# EAGLE design ESP32-Mini-Matrix-Shield-DMA (EAGLE 9.6.2)
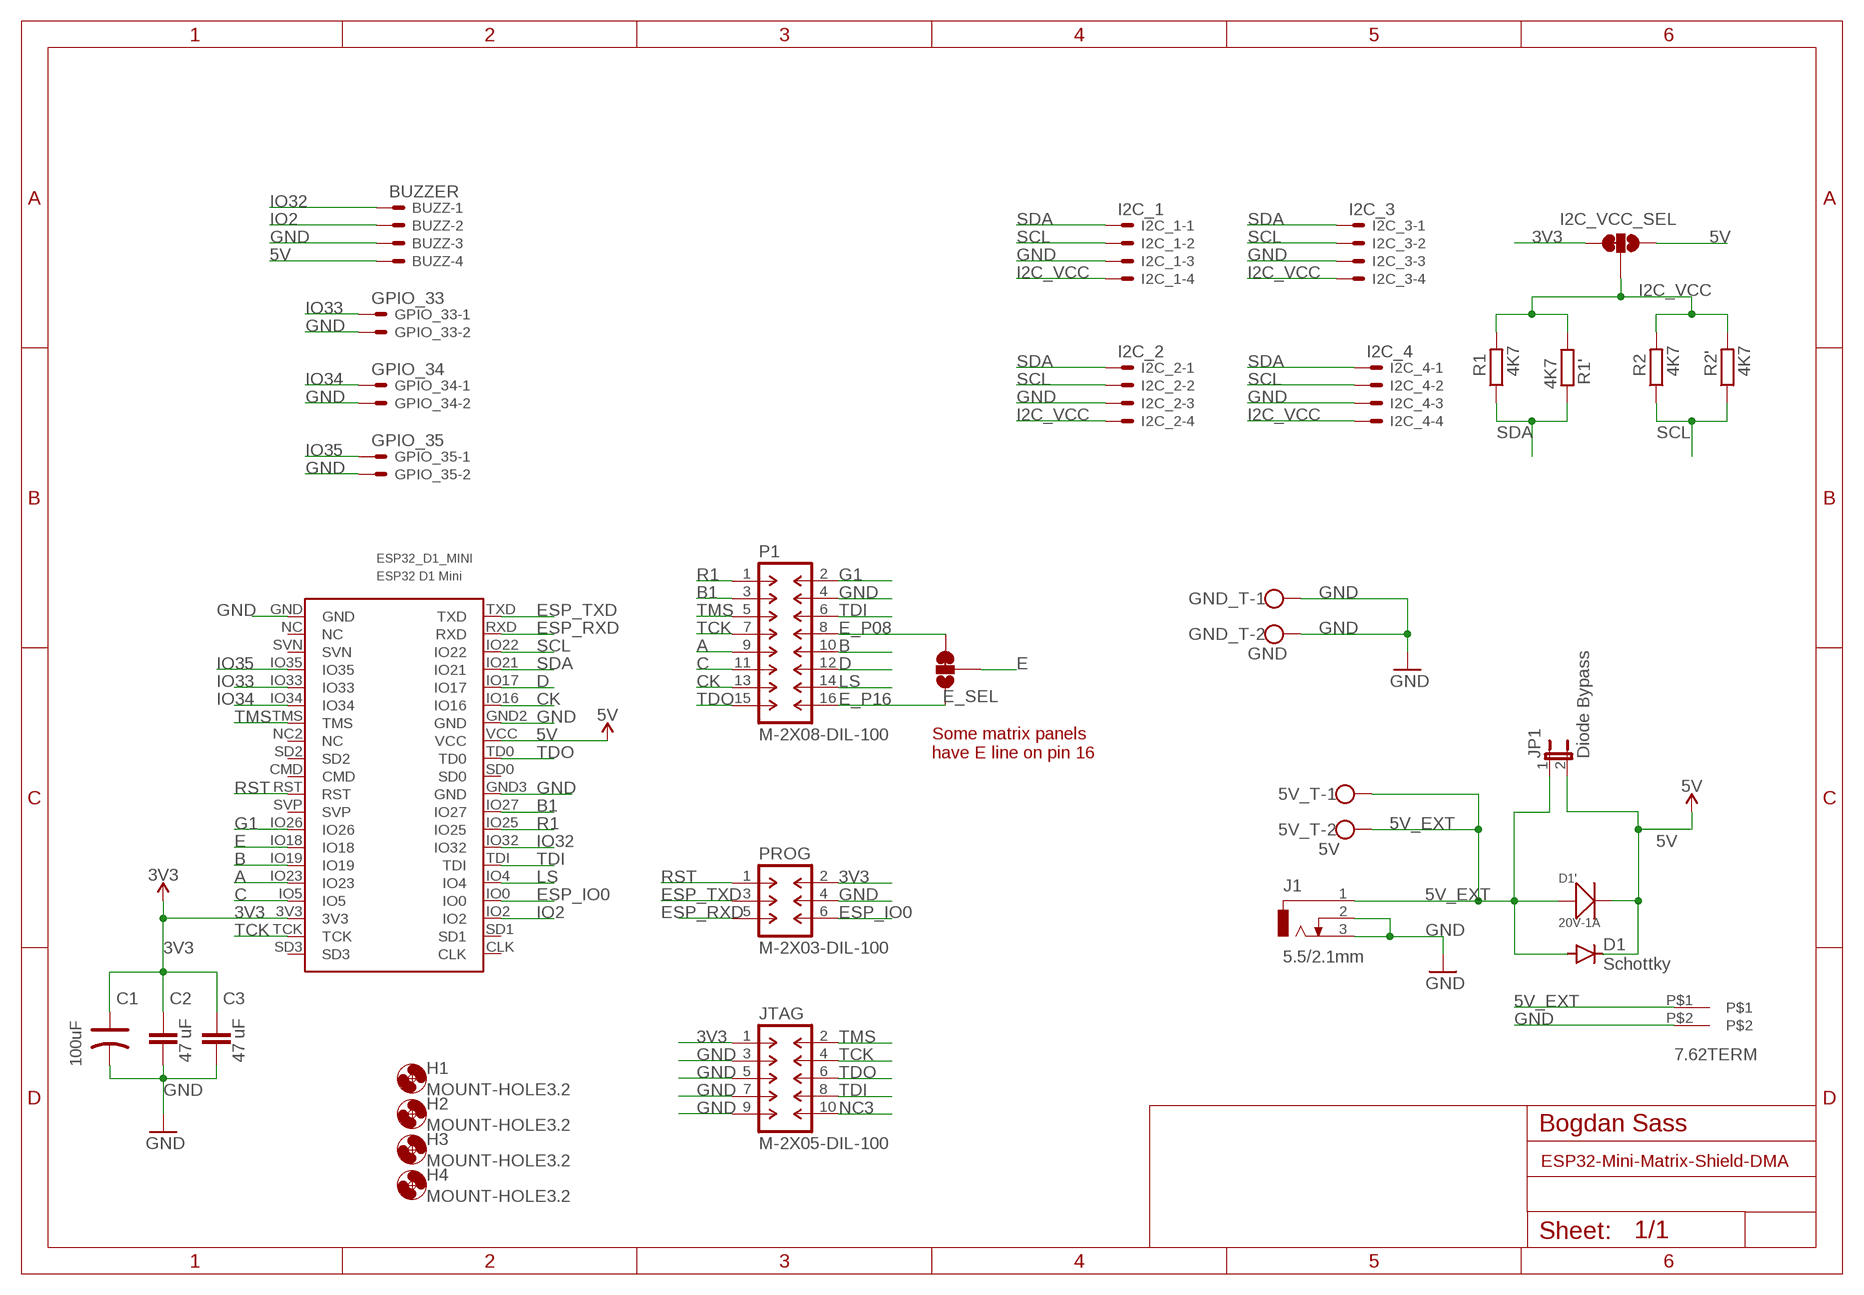
[diagram p0: schematic, sheet 1]

## Parts
5V_T  5V  W237-102  [W237-102]
BUZZ  BUZZER  JST-XH-04-PIN-LONG-PAD  [JST-XH-04-PACKAGE-LONG-PAD]
C1  100uF  DIP-ALUMINUM-47UF-16V(D5-H7MM)  [PC-D5.3MM]
C2  47 uF  CAP0805-CAP-LARGEPADS  [0805-CAP-LARGEPADS]
C3  47 uF  CAP0805-CAP-LARGEPADS  [0805-CAP-LARGEPADS]
D1  Schottky  1N4004  [DO41-10]
D1'  20V-1A  SMD-DIODE-SCHOTTKY-20V-1A(SOD-123)  [SOD-123]
E_SEL  JUMPER-SMT_3_1-NC_TRACE_SILK  [SMT-JUMPER_3_1-NC_TRACE_SILK]
ESP32_D1_MINI  ESP32 D1 Mini  MH-ET_ESP32_D1_MINI  [MH-ET_ESP32_D1_MINI]
GND_T  GND  W237-102  [W237-102]
GPIO_33  GPIO_33  JST-XH-02-PIN-LONG-PAD  [JST-XH-02-PACKAGE-LONG-PAD]
GPIO_34  GPIO_34  JST-XH-02-PIN-LONG-PAD  [JST-XH-02-PACKAGE-LONG-PAD]
GPIO_35  GPIO_35  JST-XH-02-PIN-LONG-PAD  [JST-XH-02-PACKAGE-LONG-PAD]
H1  MOUNT-HOLE3.2  [3,2]
H2  MOUNT-HOLE3.2  [3,2]
H3  MOUNT-HOLE3.2  [3,2]
H4  MOUNT-HOLE3.2  [3,2]
I2C_1  I2C_1  JST-XH-04-PIN-LONG-PAD  [JST-XH-04-PACKAGE-LONG-PAD]
I2C_2  I2C_2  JST-XH-04-PIN-LONG-PAD  [JST-XH-04-PACKAGE-LONG-PAD]
I2C_3  I2C_3  JST-XH-04-PIN-LONG-PAD  [JST-XH-04-PACKAGE-LONG-PAD]
I2C_4  I2C_4  JST-XH-04-PIN-LONG-PAD  [JST-XH-04-PACKAGE-LONG-PAD]
I2C_VCC_SEL  JUMPER-SMT_3_1-NC_TRACE_SILK  [SMT-JUMPER_3_1-NC_TRACE_SILK]
J1  5.5/2.1mm  DCJ0303  [DCJ0303]
JP1  Diode Bypass  JP1E  [JP1]
JTAG  M-2X05-DIL-100  [DIL-100-2X05]
P1  M-2X08-DIL-100  [DIL-100-2X08]
PROG  M-2X03-DIL-100  [DIL-100-2X03]
R1  4K7  R-EU_0207/10  [0207/10]
R1'  4K7  R-EU_M0805  [M0805]
R2  4K7  R-EU_0207/10  [0207/10]
R2'  4K7  R-EU_M0805  [M0805]
ST_01  ST_01  CON-TERM-7.62  [CON-TERM-7.62]

## Nets
3V3: C1.+ C2.1 C3.1 ESP32_D1_MINI.3V3 I2C_VCC_SEL.3 JTAG.1 PROG.2
5V: BUZZ.4 D1'.- D1.C ESP32_D1_MINI.VCC I2C_VCC_SEL.1 JP1.2
5V_EXT: 5V_T.1 5V_T.2 D1'.+ D1.A J1.1 JP1.1 ST_01.P$1
A: ESP32_D1_MINI.IO23 P1.9
B: ESP32_D1_MINI.IO19 P1.10
B1: ESP32_D1_MINI.IO27 P1.3
C: ESP32_D1_MINI.IO5 P1.11
CK: ESP32_D1_MINI.IO16 P1.13
D: ESP32_D1_MINI.IO17 P1.12
E: E_SEL.2 ESP32_D1_MINI.IO18
E_P08: E_SEL.3 P1.8
E_P16: E_SEL.1 P1.16
ESP_IO0: ESP32_D1_MINI.IO0 PROG.6
ESP_RXD: ESP32_D1_MINI.RXD PROG.5
ESP_TXD: ESP32_D1_MINI.TXD PROG.3
G1: ESP32_D1_MINI.IO26 P1.2
GND: BUZZ.3 C1.- C2.2 C3.2 ESP32_D1_MINI.GND ESP32_D1_MINI.GND2(GND) ESP32_D1_MINI.GND3(GND) GND_T.1 GND_T.2 GPIO_33.2 GPIO_34.2 GPIO_35.2 I2C_1.3 I2C_2.3 I2C_3.3 I2C_4.3 J1.2 J1.3 JTAG.3 JTAG.5 JTAG.7 JTAG.9 P1.4 PROG.4 ST_01.P$2
I2C_VCC: I2C_1.4 I2C_2.4 I2C_3.4 I2C_4.4 I2C_VCC_SEL.2 R1'.1 R1.2 R2'.2 R2.2
IO2: BUZZ.2 ESP32_D1_MINI.IO2
IO32: BUZZ.1 ESP32_D1_MINI.IO32
IO33: ESP32_D1_MINI.IO33 GPIO_33.1
IO34: ESP32_D1_MINI.IO34 GPIO_34.1
IO35: ESP32_D1_MINI.IO35 GPIO_35.1
LS: ESP32_D1_MINI.IO4 P1.14
NC3: JTAG.10
R1: ESP32_D1_MINI.IO25 P1.1
RST: ESP32_D1_MINI.RST PROG.1
SCL: ESP32_D1_MINI.IO22 I2C_1.2 I2C_2.2 I2C_3.2 I2C_4.2 R2'.1 R2.1
SDA: ESP32_D1_MINI.IO21 I2C_1.1 I2C_2.1 I2C_3.1 I2C_4.1 R1'.2 R1.1
TCK: ESP32_D1_MINI.TCK JTAG.4 P1.7
TDI: ESP32_D1_MINI.TDI JTAG.8 P1.6
TDO: ESP32_D1_MINI.TD0 JTAG.6 P1.15
TMS: ESP32_D1_MINI.TMS JTAG.2 P1.5
Unconnected: ESP32_D1_MINI.CLK ESP32_D1_MINI.CMD ESP32_D1_MINI.NC ESP32_D1_MINI.NC2(NC) ESP32_D1_MINI.SD0 ESP32_D1_MINI.SD1 ESP32_D1_MINI.SD2 ESP32_D1_MINI.SD3 ESP32_D1_MINI.SVN ESP32_D1_MINI.SVP

## Notes on the sheet
- Some matrix panels
  have E line on pin 16
- Bogdan Sass

## Library data of the parts
5V_T GND_T = con-wago-500:W237-102: WAGO SCREW CLAMP; MPN: 237-102; OC_FARNELL: unknown; OC_NEWARK: 70K9898
BUZZ I2C_1-I2C_4 = Rembrandt Electronics - JST XH Connectors v1-0:JST-XH-04-PIN: JST XH Connector 2 Pin Wire to board connector. Pitch: 2,54 mm, (0.100") Number of pins: 4 Created by Rembrandt Electronics www.rembrandtelectronics.com
C1 = Seeed-Capacitor:DIP-ALUMINUM-47UF-16V(D5-H7MM): 302030033; MPN: KS 100uF/16V; VALUE: 100uf
C2 C3 = _c2h:CAP: Capacitor Standard 0603 ceramic capacitor, and 0.1" leaded capacitor.
D1 = diode:1N4004: DIODE general purpose rectifier, 1 A
D1' = OPL_Discrete_Semiconductor:SMD-DIODE-SCHOTTKY-20V-1A(SOD-123): 304020034; MPN: B5819W
E_SEL I2C_VCC_SEL = SparkFun-Jumpers:JUMPER-SMT_3_1-NC_TRACE: Normally closed trace jumper (1 of 2 connections) This jumper has a trace between two pads so it's normally closed (NC). The other connection is normally open (NO). Use a razor knife to open the connection. For best results follow the IPC guidelines for cutting traces: Cutout at least 0.063 mm (0.005 in). Remove all loose material to clean up the cut area. Seal the cut with an approved epoxy. Reapply solder to reclose the connection, or to close the NO connection.
ESP32_D1_MINI = MH-ET_ESP32_D1_MINI:MH-ET_ESP32_D1_MINI
GPIO_33-GPIO_35 = Rembrandt Electronics - JST XH Connectors v1-0:JST-XH-02-PIN: JST XH Connector 2 Pin Wire to board connector. Pitch: 2,54 mm, (0.100") Number of pins: 2 Created by Rembrandt Electronics www.rembrandtelectronics.com
H1-H4 = holes:MOUNT-HOLE: MOUNTING HOLE with drill center marker
J1 = con-jack:DCJ0303: DC POWER JACK Source: DCJ0303.pdf; OC_FARNELL: unknown; OC_NEWARK: unknown
JP1 = jumper:JP1E: JUMPER
JTAG = con-headers-jp:M-2X05-: MALE HEADER
P1 = con-headers-jp:M-2X08-: MALE HEADER
PROG = con-headers-jp:M-2X03-: MALE HEADER
R1 R1' R2 R2' = rcl:R-EU_: RESISTOR, European symbol; SPICEPREFIX: R
ST_01 = terminal-block:CON-TERM-7.62: 7.62mm screw terminal barrier block

## Board
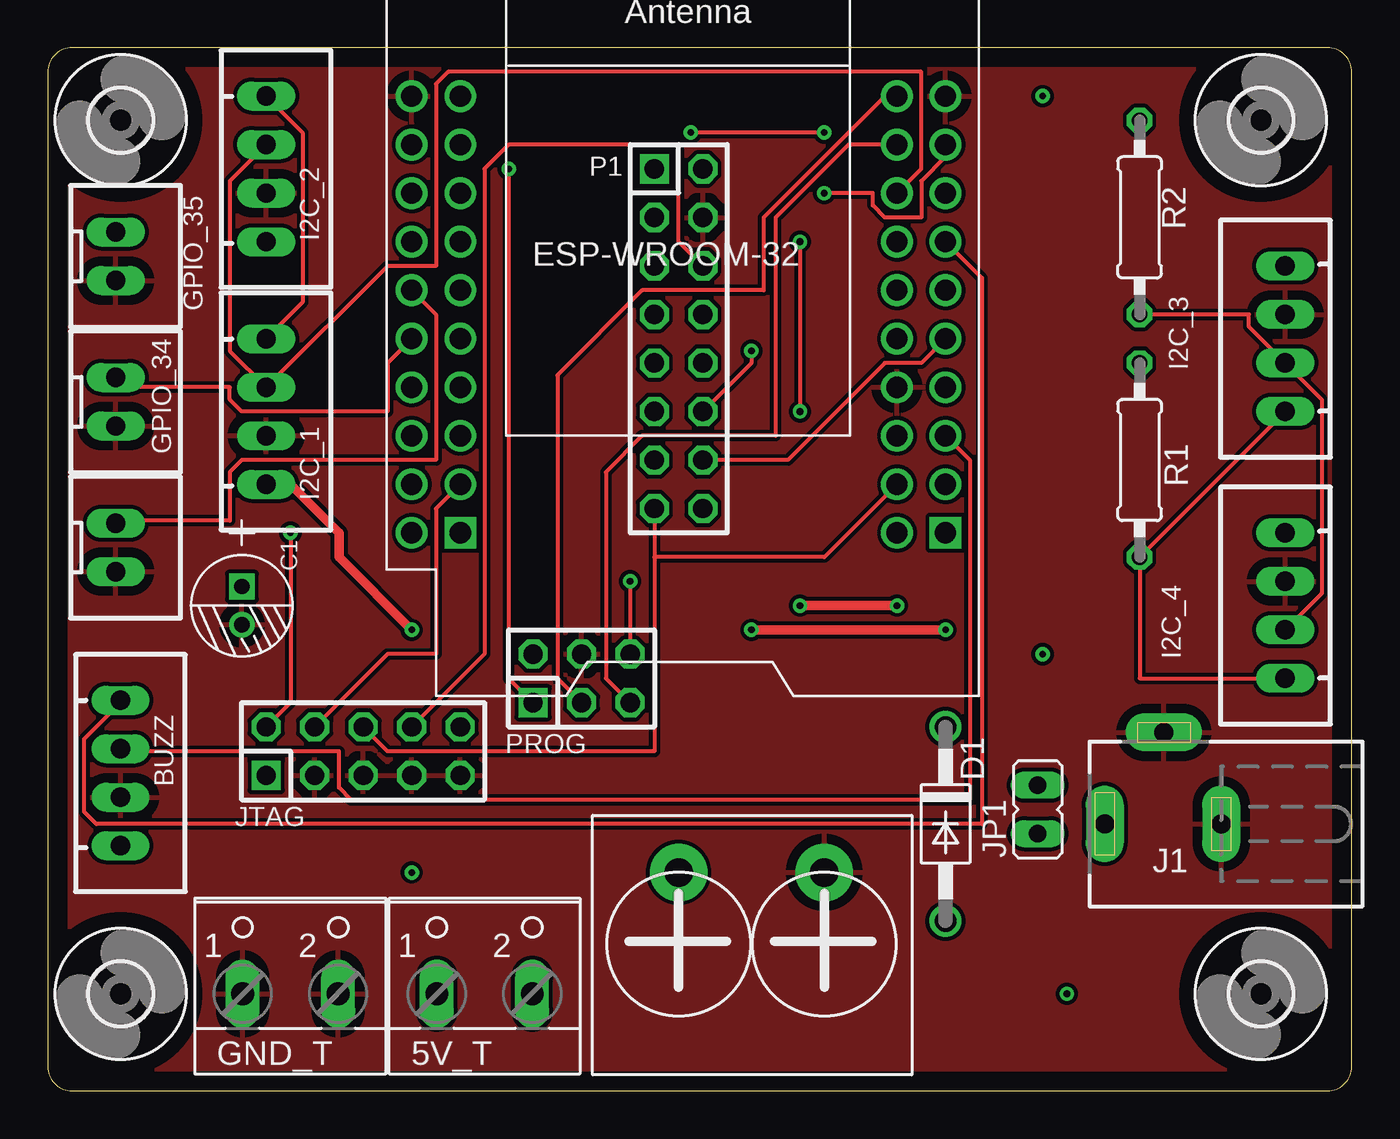
[diagram p1: board, top side]
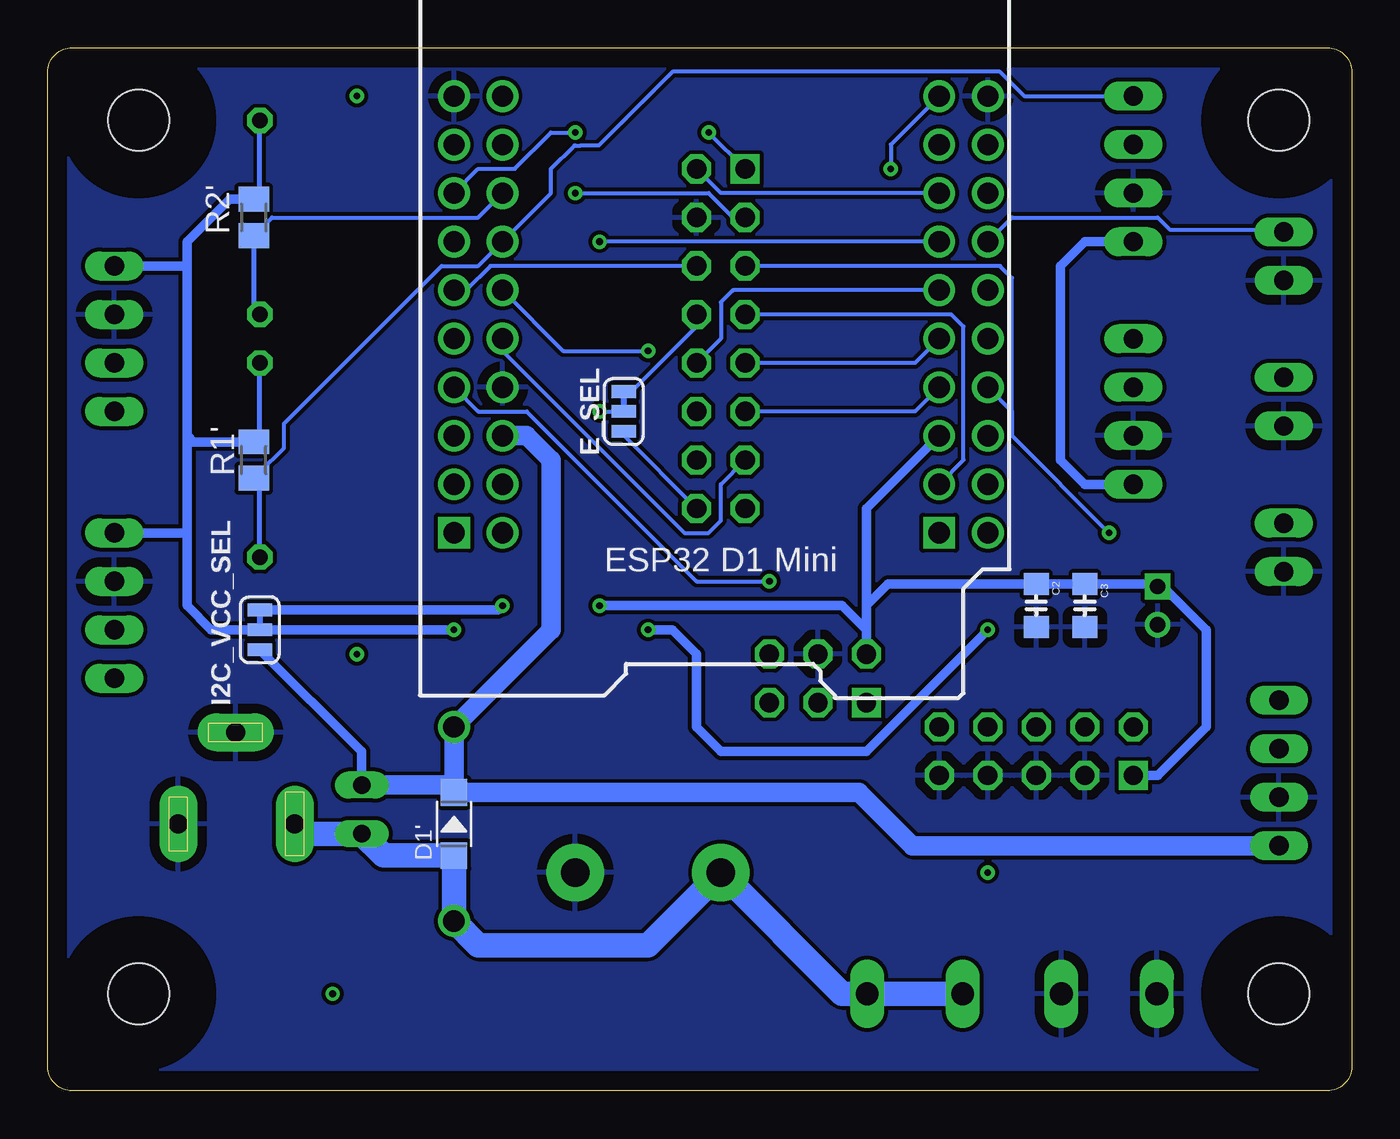
[diagram p2: board, bottom side, seen from below]

Size 68.25 x 54.6 mm. Coordinates in mm from the lower left corner, seen from the top.
Outline: 68.25,1.27 68.25,53.33 arc90 66.98,54.6 1.27,54.6 arc90 0,53.33 0,1.27 arc90 1.27,0 66.98,0 arc90 68.25,1.27
Copper layers (1*16): Top 0.035mm / dielectric 1.5mm / Bottom 0.035mm
Design rules "default *": minimum track width 8mil, minimum drill 0.35mm, track to track 8mil, track to pad 8mil, pad to pad 8mil, via to via 8mil, smd to smd 8mil, copper to edge 40mil, drill to drill 6mil, minimum pad ring 10mil, minimum via ring 8mil, stop-mask expansion 4mil, vias tented up to drill 0mil, thermal gap 20mil

### Footprints (pad centres in the part's own frame; a part is rotated, then mirrored left to right if it is on the bottom)
W237-102 = drill 1.194 long: 1 -2.5,-1.27; 2 2.5,-1.27
JST-XH-04-PACKAGE-LONG-PAD = drill 1.016 long: 1 -3.81,0; 2 -1.27,0; 3 1.27,0; 4 3.81,0
PC-D5.3MM = drill 0.8 pad 1.35 square: + -1,0 | drill 0.8 pad 1.35: - 1,0
0805-CAP-LARGEPADS = smd 1.156 x 1.3: 1 -1.127,0; 2 1.127,0
DO41-10 = drill 1.118: A 5.08,0; C -5.08,0
SOD-123 = smd 1.397 x 1.397: + -1.651,0; - 1.651,0
SMT-JUMPER_3_1-NC_TRACE_SILK = smd 0.66 x 1.27: 1 -1.041,0; 2 0,0; 3 1.041,0
MH-ET_ESP32_D1_MINI = drill 1.11 pad 1.665: 3V3 25.4,-5.08; CMD 27.94,0; GND 0,-22.86; GND2 2.54,-7.62; GND3 27.94,-22.86; IO0 0,-7.62; IO2 0,-5.08; IO4 0,-10.16; IO5 25.4,-7.62; IO16 2.54,-10.16; IO17 2.54,-12.7; IO18 25.4,-15.24; IO19 25.4,-12.7; IO21 2.54,-15.24; IO22 2.54,-17.78; IO23 25.4,-10.16; IO25 0,-17.78; IO26 25.4,-17.78; IO27 0,-20.32; IO32 0,-15.24; IO33 27.94,-12.7; IO34 27.94,-10.16; IO35 27.94,-15.24; NC 27.94,-20.32; NC2 27.94,-5.08; RST 25.4,-22.86; RXD 2.54,-20.32; SD0 2.54,0; SD1 0,-2.54; SD2 27.94,-2.54; SVN 27.94,-17.78; SVP 25.4,-20.32; TCK 25.4,-2.54; TD0 2.54,-2.54; TDI 0,-12.7; TMS 27.94,-7.62; TXD 2.54,-22.86; VCC 2.54,-5.08 | drill 1.11 pad 1.665 square: CLK 0,0; SD3 25.4,0
JST-XH-02-PACKAGE-LONG-PAD = drill 1.016 long: 1 -1.27,0; 2 1.27,0
3,2 = hole 3.2: 0,0
DCJ0303 = drill 1 pad 2 long: 1 0,3.1; 2 4.8,0; 3 0,-3
JP1 = drill 0.914 long: 1 0,-1.27; 2 0,1.27
DIL-100-2X05 = drill 1.016 square: 1 -5.08,-1.27 | drill 1.016 octagon: 2 -5.08,1.27; 3 -2.54,-1.27; 4 -2.54,1.27; 5 0,-1.27; 6 0,1.27; 7 2.54,-1.27; 8 2.54,1.27; 9 5.08,-1.27; 10 5.08,1.27
DIL-100-2X08 = drill 1.016 square: 1 -8.89,-1.27 | drill 1.016 octagon: 2 -8.89,1.27; 3 -6.35,-1.27; 4 -6.35,1.27; 5 -3.81,-1.27; 6 -3.81,1.27; 7 -1.27,-1.27; 8 -1.27,1.27; 9 1.27,-1.27; 10 1.27,1.27; 11 3.81,-1.27; 12 3.81,1.27; 13 6.35,-1.27; 14 6.35,1.27; 15 8.89,-1.27; 16 8.89,1.27
DIL-100-2X03 = drill 1.016 square: 1 -2.54,-1.27 | drill 1.016 octagon: 2 -2.54,1.27; 3 0,-1.27; 4 0,1.27; 5 2.54,-1.27; 6 2.54,1.27
0207/10 = drill 0.813 octagon: 1 -5.08,0; 2 5.08,0
M0805 = smd 1.3 x 1.6: 1 -0.95,0; 2 0.95,0
CON-TERM-7.62 = drill 1.5 pad 3: P$1 0,0; P$2 7.62,0

### Placement (x,y rotation side)
5V_T  22.86,6.35 0 top
BUZZ  3.81,16.64 270 top
C1  10.16,25.4 270 top
C2  16.51,25.4 270 bottom
C3  13.97,25.4 270 bottom
D1  46.99,13.97 270 top
D1'  46.99,13.97 90 bottom
E_SEL  38.1,35.56 90 bottom
ESP32_D1_MINI  46.99,29.21 180 top
GND_T  12.7,6.35 0 top
GPIO_33  3.56,28.45 270 top
GPIO_34  3.56,36.07 270 top
GPIO_35  3.56,43.69 270 top
H1  63.5,5.08 0 top
H2  3.81,50.8 0 top
H3  63.5,50.8 0 top
H4  3.81,5.08 0 top
I2C_1  11.43,35.56 270 top
I2C_2  11.43,48.26 270 top
I2C_3  64.77,39.37 90 top
I2C_4  64.77,25.4 90 top
I2C_VCC_SEL  57.15,24.13 90 bottom
J1  58.42,13.97 90 top
JP1  51.82,14.73 0 top
JTAG  16.51,17.78 0 top
P1  33.02,39.37 270 top
PROG  27.94,21.59 0 top
R1  57.15,33.02 90 top
R1'  57.47,33.02 270 bottom
R2  57.15,45.72 90 top
R2'  57.47,45.72 90 bottom
ST_01  33.02,11.43 0 top

### Tracks (layer width: path | path; a pad name or v marks a point on that pad's centre or on a via)
3V3  (via drill 0.35)
  Top 0.508: v44.45,25.4 v39.37,25.4
  Bottom 0.254: 10.29,26.53 C1.+
  Bottom 0.508: ESP32_D1_MINI.3V3 25.4,30.48 25.4,25.4 | 10.29,26.53 C3.1 C2.1 24.27,26.53 25.4,25.4 | C1.+ 9.89,26.4 7.62,24.13 7.62,19.05 10.16,16.51 JTAG.1 | I2C_VCC_SEL.3 44.68,25.17 v44.45,25.4 | PROG.2 25.4,24.13 | 25.4,24.13 25.4,25.4 | 25.4,24.13 26.67,25.4 v39.37,25.4
5V
  Bottom 0.508: JP1.2 51.82,17.75 I2C_VCC_SEL.1
  Bottom 1.016: JP1.2 47.37,16 D1'.- | D1'.- D1.C 41.91,24.13 41.91,33.02 43.18,34.29 ESP32_D1_MINI.VCC | D1'.- 25.78,15.62 22.99,12.83 BUZZ.4
5V_EXT
  Bottom 1.27: J1.1 54.81,13.46 JP1.1 50.67,12.32 D1'.+ D1.A 45.72,7.62 36.83,7.62 ST_01.P$1 26.67,5.08 5V_T.2 5V_T.1
A
  Bottom 0.203: P1.9 22.86,38.1 ESP32_D1_MINI.IO23
B
  Bottom 0.203: P1.10 33.02,39.37 33.02,41.28 32.38,41.91 ESP32_D1_MINI.IO19
B1  (via drill 0.35)
  Top 0.203: v40.64,46.99 43.18,46.99 43.18,46.36 43.81,45.72 45.72,45.72 45.72,47.62 46.99,48.9 ESP32_D1_MINI.IO27
  Bottom 0.203: P1.3 32.38,45.72 33.65,46.99 v40.64,46.99
C
  Bottom 0.203: P1.11 22.86,35.56 ESP32_D1_MINI.IO5
CK
  Bottom 0.203: P1.13 33.02,31.75 33.02,29.84 33.65,29.21 34.92,29.21 44.45,38.74 ESP32_D1_MINI.IO16
D  (via drill 0.35)
  Top 0.203: P1.12 36.83,38.1 v36.83,38.74
  Bottom 0.203: v36.83,38.74 41.27,38.74 ESP32_D1_MINI.IO17
E  (via drill 0.35)
  Top 0.203: v39.37,44.45 v39.37,35.56
  Bottom 0.203: v39.37,35.56 E_SEL.2 | ESP32_D1_MINI.IO18 v39.37,44.45
E_P08
  Bottom 0.203: P1.8 34.29,40.01 37.46,36.83 38.1,36.83 E_SEL.3
E_P16
  Bottom 0.203: P1.16 38.1,34.29 E_SEL.1
ESP_IO0  (via drill 0.35)
  Top 0.203: v30.48,26.67 PROG.6
  Bottom 0.203: v30.48,26.67 34.29,26.67 43.18,35.56 45.72,35.56 ESP32_D1_MINI.IO0
ESP_RXD
  Top 0.203: PROG.5 29.21,21.59 29.21,32.38 31.11,34.29 38.1,34.29 38.1,45.72 41.91,49.53 ESP32_D1_MINI.RXD
ESP_TXD
  Top 0.203: PROG.3 26.67,21.59 26.67,37.47 31.11,41.91 37.46,41.91 37.46,45.72 43.81,52.07 ESP32_D1_MINI.TXD
G1
  Bottom 0.203: P1.2 33.02,46.99 ESP32_D1_MINI.IO26
GND
  pour Bottom: -2.54,59.69 71.12,59.69 71.12,-1.27 -2.54,-1.27
  pour Top (isolate 0.203): -1.27,58.42 69.85,58.42 69.85,0 -1.27,0
I2C_VCC  (via drill 0.35)
  Top 0.508: v36.83,24.13 v46.99,24.13 | v19.05,24.13 15.24,27.94 15.24,29.21 12.7,31.75 I2C_1.4
  Bottom 0.254: R1'.1 57.15,34.29 R1.2 | R2'.2 57.15,46.99 R2.2
  Bottom 0.508: R2'.2 58.74,46.67 60.96,44.45 60.96,43.18 | I2C_3.4 60.96,43.18 | 60.96,43.18 60.96,34.29 | 60.96,34.29 60.64,33.97 R1'.1 | 60.96,34.29 60.96,29.21 | 60.96,29.21 60.96,25.4 59.69,24.13 I2C_VCC_SEL.2 v46.99,24.13 | I2C_4.4 60.96,29.21 | v19.05,24.13 25.4,17.78 33.02,17.78 34.29,19.05 34.29,22.86 35.56,24.13 v36.83,24.13 | I2C_1.4 13.97,31.75 15.24,33.02 15.24,43.18 13.97,44.45 I2C_2.4
IO2
  Top 0.203: ESP32_D1_MINI.IO2 48.26,33.02 48.26,15.24 15.88,15.24 15.24,15.88 15.24,17.78 3.81,17.78 BUZZ.2
IO32
  Top 0.203: ESP32_D1_MINI.IO32 48.89,42.55 48.89,13.97 2.54,13.97 1.9,14.61 1.9,18.41 3.81,20.32 BUZZ.1
IO33
  Top 0.203: ESP32_D1_MINI.IO33 20.32,40.64 20.32,33.02 10.16,33.02 9.53,32.38 9.53,29.84 3.81,29.84 GPIO_33.1
IO34
  Top 0.203: ESP32_D1_MINI.IO34 17.78,38.1 17.78,35.56 10.16,35.56 9.53,36.2 9.53,36.83 3.81,36.83 GPIO_34.1
IO35
  Bottom 0.203: ESP32_D1_MINI.IO35 17.78,45.72 10.16,45.72 9.53,45.09 3.81,45.09 GPIO_35.1
LS
  Top 0.203: P1.14 38.73,33.02 43.81,38.1 45.72,38.1 ESP32_D1_MINI.IO4
N$1  (via drill 0.35)
  other vias: 52.07,52.07
N$2  (via drill 0.35)
  other vias: 52.07,22.86
N$3  (via drill 0.35)
  other vias: 53.34,5.08
N$4  (via drill 0.35)
  other vias: 19.05,11.43
R1  (via drill 0.35)
  Top 0.203: v40.64,50.17 v33.65,50.17
  Bottom 0.203: v33.65,50.17 P1.1 | v40.64,50.17 41.91,50.17 43.81,48.26 45.72,48.26 ESP32_D1_MINI.IO25
RST  (via drill 0.35)
  Top 0.203: PROG.1 24.13,21.59 v24.13,48.26
  Bottom 0.203: v24.13,48.26 24.13,49.53 ESP32_D1_MINI.RST
SCL
  Top 0.203: I2C_2.2 9.53,47.62 9.53,38.74 I2C_1.2 17.78,43.18 20.32,43.18 20.32,52.71 20.96,53.34 45.72,53.34 45.72,48.26 ESP32_D1_MINI.IO22 | I2C_4.2 66.67,26.04 66.67,36.2 I2C_3.2 62.87,40.01 62.87,40.64 R2.1
  Bottom 0.203: ESP32_D1_MINI.IO22 45.72,45.72 56.51,45.72 57.15,45.09 R2'.1
  Bottom 0.254: R2'.1 57.47,40.96 R2.1
SDA
  Top 0.203: I2C_1.1 13.34,41.28 13.34,50.17 I2C_2.1 | I2C_4.1 57.15,21.59 R1.1 I2C_3.1
  Bottom 0.203: R1'.2 57.15,32.38 55.88,33.66 55.88,34.93 47.62,43.18 45.72,43.18 ESP32_D1_MINI.IO21 41.91,46.99 41.91,48.26 40.69,49.48 40.64,49.48 40.36,49.48 39.42,49.48 35.56,53.34 18.41,53.34 18.1,53.02 17.14,52.07 I2C_2.1
  Bottom 0.254: R1.1 57.15,31.75 R1'.2
TCK
  Top 0.203: JTAG.4 17.78,22.86 20.32,22.86 20.32,30.48 ESP32_D1_MINI.TCK
  Bottom 0.203: P1.7 20.96,40.64 20.32,40.01 20.32,33.02 ESP32_D1_MINI.TCK
TDI
  Top 0.203: JTAG.8 22.86,22.86 22.86,48.26 24.13,49.53 33.02,49.53 33.02,44.45 P1.6
  Bottom 0.203: ESP32_D1_MINI.TDI 46.35,41.91 45.08,43.18 P1.6
TDO
  Top 0.203: JTAG.6 17.78,17.78 31.75,17.78 31.75,27.94 | P1.15 31.75,27.94 | ESP32_D1_MINI.TD0 40.64,27.94 31.75,27.94
TMS  (via drill 0.35)
  Top 0.203: JTAG.2 12.7,20.32 v12.7,29.21
  Bottom 0.203: v12.7,29.21 17.78,34.29 17.78,35.56 | ESP32_D1_MINI.TMS 17.78,35.56 | P1.5 18.41,43.18 17.78,42.55 17.78,35.56

### Text on the board
bPlace: ESP32 D1 Mini
bValues: PIN 08 | PIN 16 | 3V3 | 5V
tDocu: SDA | Mount D1 Mini on other side / of the board, metal plate this way! | SCL | GND | IO35 | VCC | GND | VCC | SDA | GND | IO34 | SCL | ESP32 Matrix DMA Shield v0.3 / http://github.com/bogd | SCL | GND | GND | Connector pins / facing this side | SDA | VCC | IO33 | VCC | GND | GND | SCL | IO32 | SDA | IO2 | GND | 5V | GND | 5V
bDocu: SDA | Mount on this side of the board, / metal plate should not be visible! | SCL | GND | IO35 | I2C_2 | VCC | GND | VCC | SDA | GND | IO34 | SCL | I2C_3 | SCL | ESP32 Matrix DMA Shield v0.3 / http://github.com/bogd | GND | GND | I2C_1 | SDA | VCC | IO33 | VCC | GND | GND | I2C_4 | SCL | IO32 | SDA | IO2 | GND | 5V | 5V | GND | GND | 5V | 5V | GND